# EasyEDA schematic Power_Logger.json
TITLE: Sheet_1; REV: 1.0; Date: 2024-09-20; Sheet: 1/1; Company: Your Company
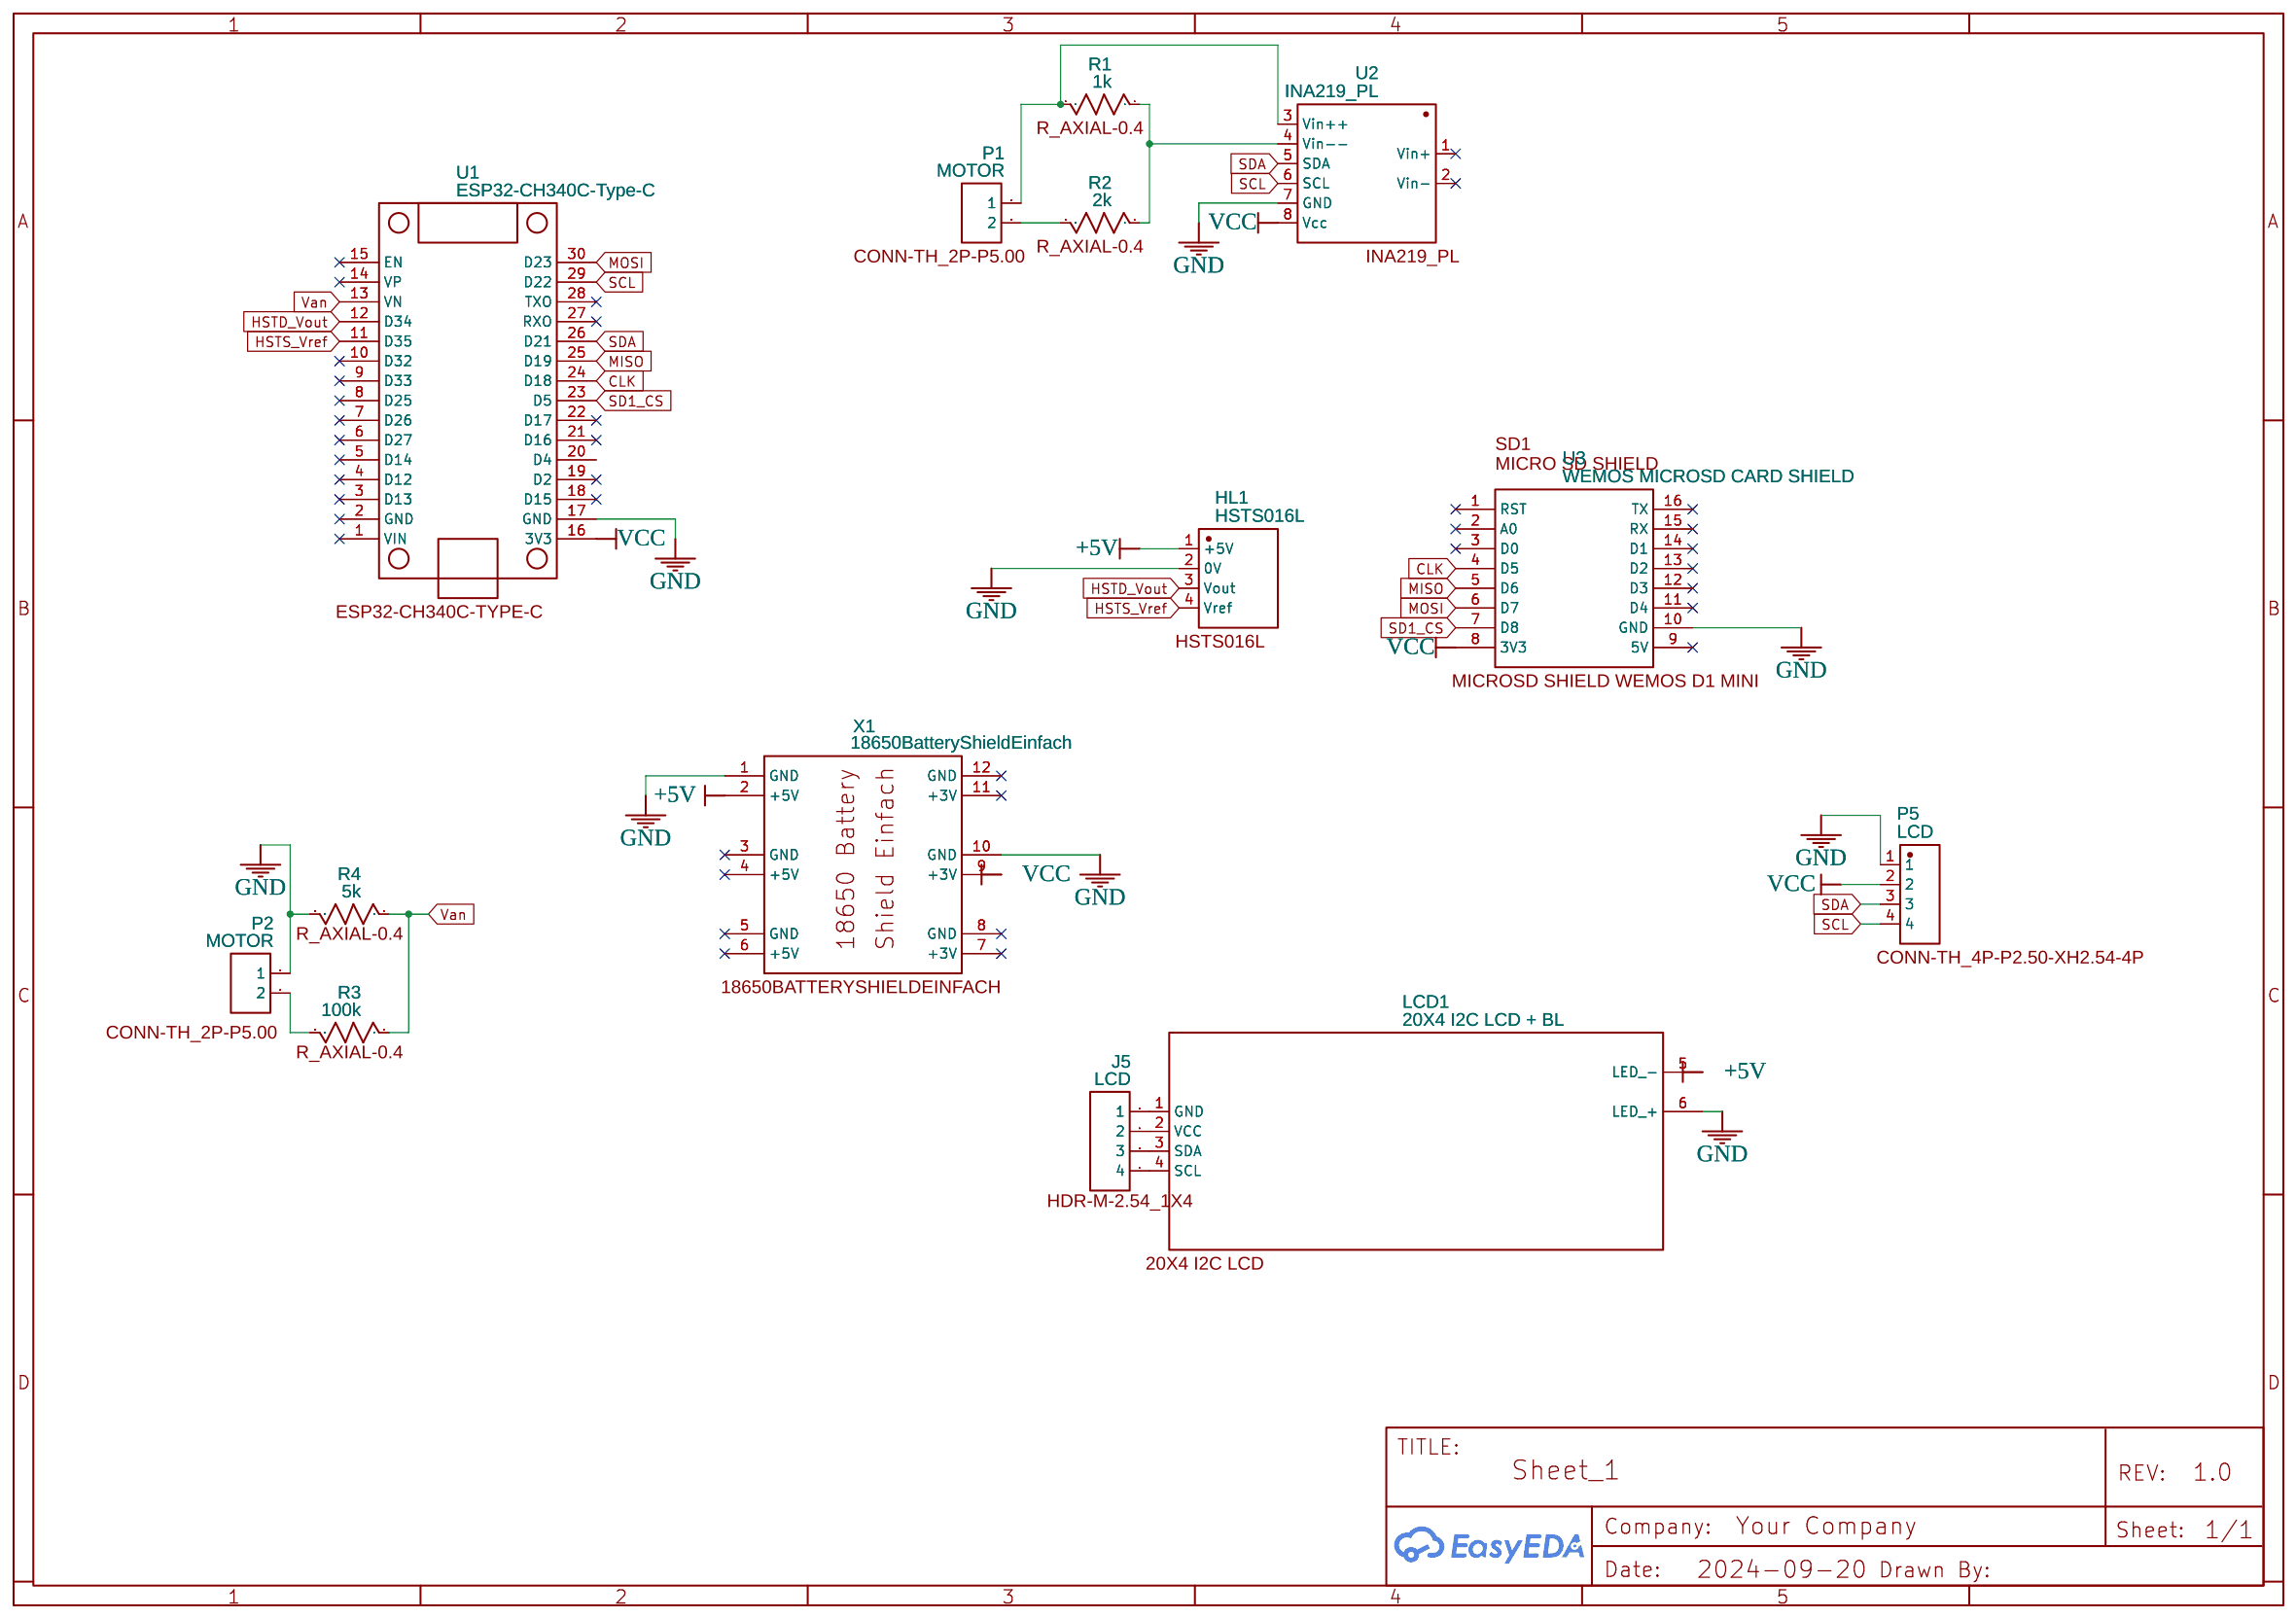
[diagram p0: schematic sheet]

## Parts
HL1  HSTS016L  [HSTS016L]
J5  LCD  [HDR-M-2.54_1X4]
LCD1  20X4 I2C LCD + BL  [20X4 I2C LCD]
P1  MOTOR  [CONN-TH_2P-P5.00]
P2  MOTOR  [CONN-TH_2P-P5.00]
P5  LCD  [CONN-TH_4P-P2.50-XH2.54-4P]
R1  1k  [R_AXIAL-0.4]
R2  2k  [R_AXIAL-0.4]
R3  100k  [R_AXIAL-0.4]
R4  5k  [R_AXIAL-0.4]
U1  ESP32-CH340C-Type-C  [ESP32-CH340C-TYPE-C]
U2  INA219_PL  [INA219_PL]
U3  WEMOS MICROSD CARD SHIELD  [MICROSD SHIELD WEMOS D1 MINI]
X1  18650BatteryShieldEinfach  [18650BATTERYSHIELDEINFACH]

## Library data of the parts
HL1 = HSTS016L: Contributor: ulirberdulham; Package Display: Yes
J5 = HDR-M-2.54_1x4: Supplier Part: C124378; Supplier: LCSC; Contributor: LCEDA_Lib; Package Display: Yes
LCD1 = 20X4 I2C LCD + BL: Contributor: AnTho; Package Display: Yes
P1 P2 = CONN-TH_2P-P5.00: Supplier: LCSC; Contributor: LCEDA_Lib; Package Display: Yes
P5 = XH-2.54-4P: Contributor: LCSC; Supplier: LCSC; Supplier Part: C9900003933; Manufacturer: null; Package Display: Yes
R1-R4 = R_AXIAL-0.4_US: Contributor: LCEDA_Lib; Package Display: Yes
U1 = ESP32-CH340C-Type-C: Contributor: notan206; Package Display: Yes
U2 = INA219_PL: Contributor: Iscander_Sib; Package Display: Yes
U3 = WEMOS MICROSD CARD SHIELD: Contributor: QAingenieros; Package Display: Yes
X1 = 18650BatteryShieldEinfach: Contributor: BauerTechnology; Package Display: Yes

## Nets
+5V: HL1.1(+5V) LCD1.5(LED -) X1.2(+5V)
GND: HL1.2(0V) LCD1.6(LED +) P2.1 P5.1 R4.2 U1.17(GND) U2.7(GND) U3.10(GND) X1.1(GND) X1.10(GND)
VCC: P5.2 U1.16(3V3) U2.8(Vcc) U3.8(3V3) X1.9(+3V)
CLK: U1.24(D18) U3.4(D5)
HSTD_Vout: HL1.3(Vout) U1.12(D34)
HSTS_Vref: HL1.4(Vref) U1.11(D35)
MISO: U1.25(D19) U3.5(D6)
MOSI: U1.30(D23) U3.6(D7)
SCL: P5.4 U1.29(D22) U2.6(SCL)
SD1_CS: U1.23(D5) U3.7(D8)
SDA: P5.3 U1.26(D21) U2.5(SDA)
Van: R3.1 R4.1 U1.13(VN)
Net-(J5-1): J5.1 LCD1.1(GND)
Net-(J5-2): J5.2 LCD1.2(VCC)
Net-(J5-3): J5.3 LCD1.3(SDA)
Net-(J5-4): J5.4 LCD1.4(SCL)
Net-(P1-1): P1.1 R1.2 U2.3(Vin++)
Net-(P1-2): P1.2 R2.2
Net-(P2-2): P2.2 R3.2
Net-(R1-1): R1.1 R2.1 U2.4(Vin--)

Not connected (* = marked no-connect by the designer): U1 1(VIN)* 2(GND)* 3(D13)* 4(D12)* 5(D14)* 6(D27)* 7(D26)* 8(D25)* 9(D33)* 10(D32)* 14(VP)* 15(EN)* 18(D15)* 19(D2)* 20(D4) 21(D16)* 22(D17)* 27(RXO)* 28(TXO)*; U2 1(Vin+)* 2(Vin-)*; U3 1(RST)* 2(A0)* 3(D0)* 9(5V)* 11(D4)* 12(D3)* 13(D2)* 14(D1)* 15(RX)* 16(TX)*; X1 3(GND)* 4(+5V)* 5(GND)* 6(+5V)* 7(+3V)* 8(GND)* 11(+3V)* 12(GND)*
